# EAGLE design telemetria (EAGLE 9.7.0)

## Sheet 1 of 2
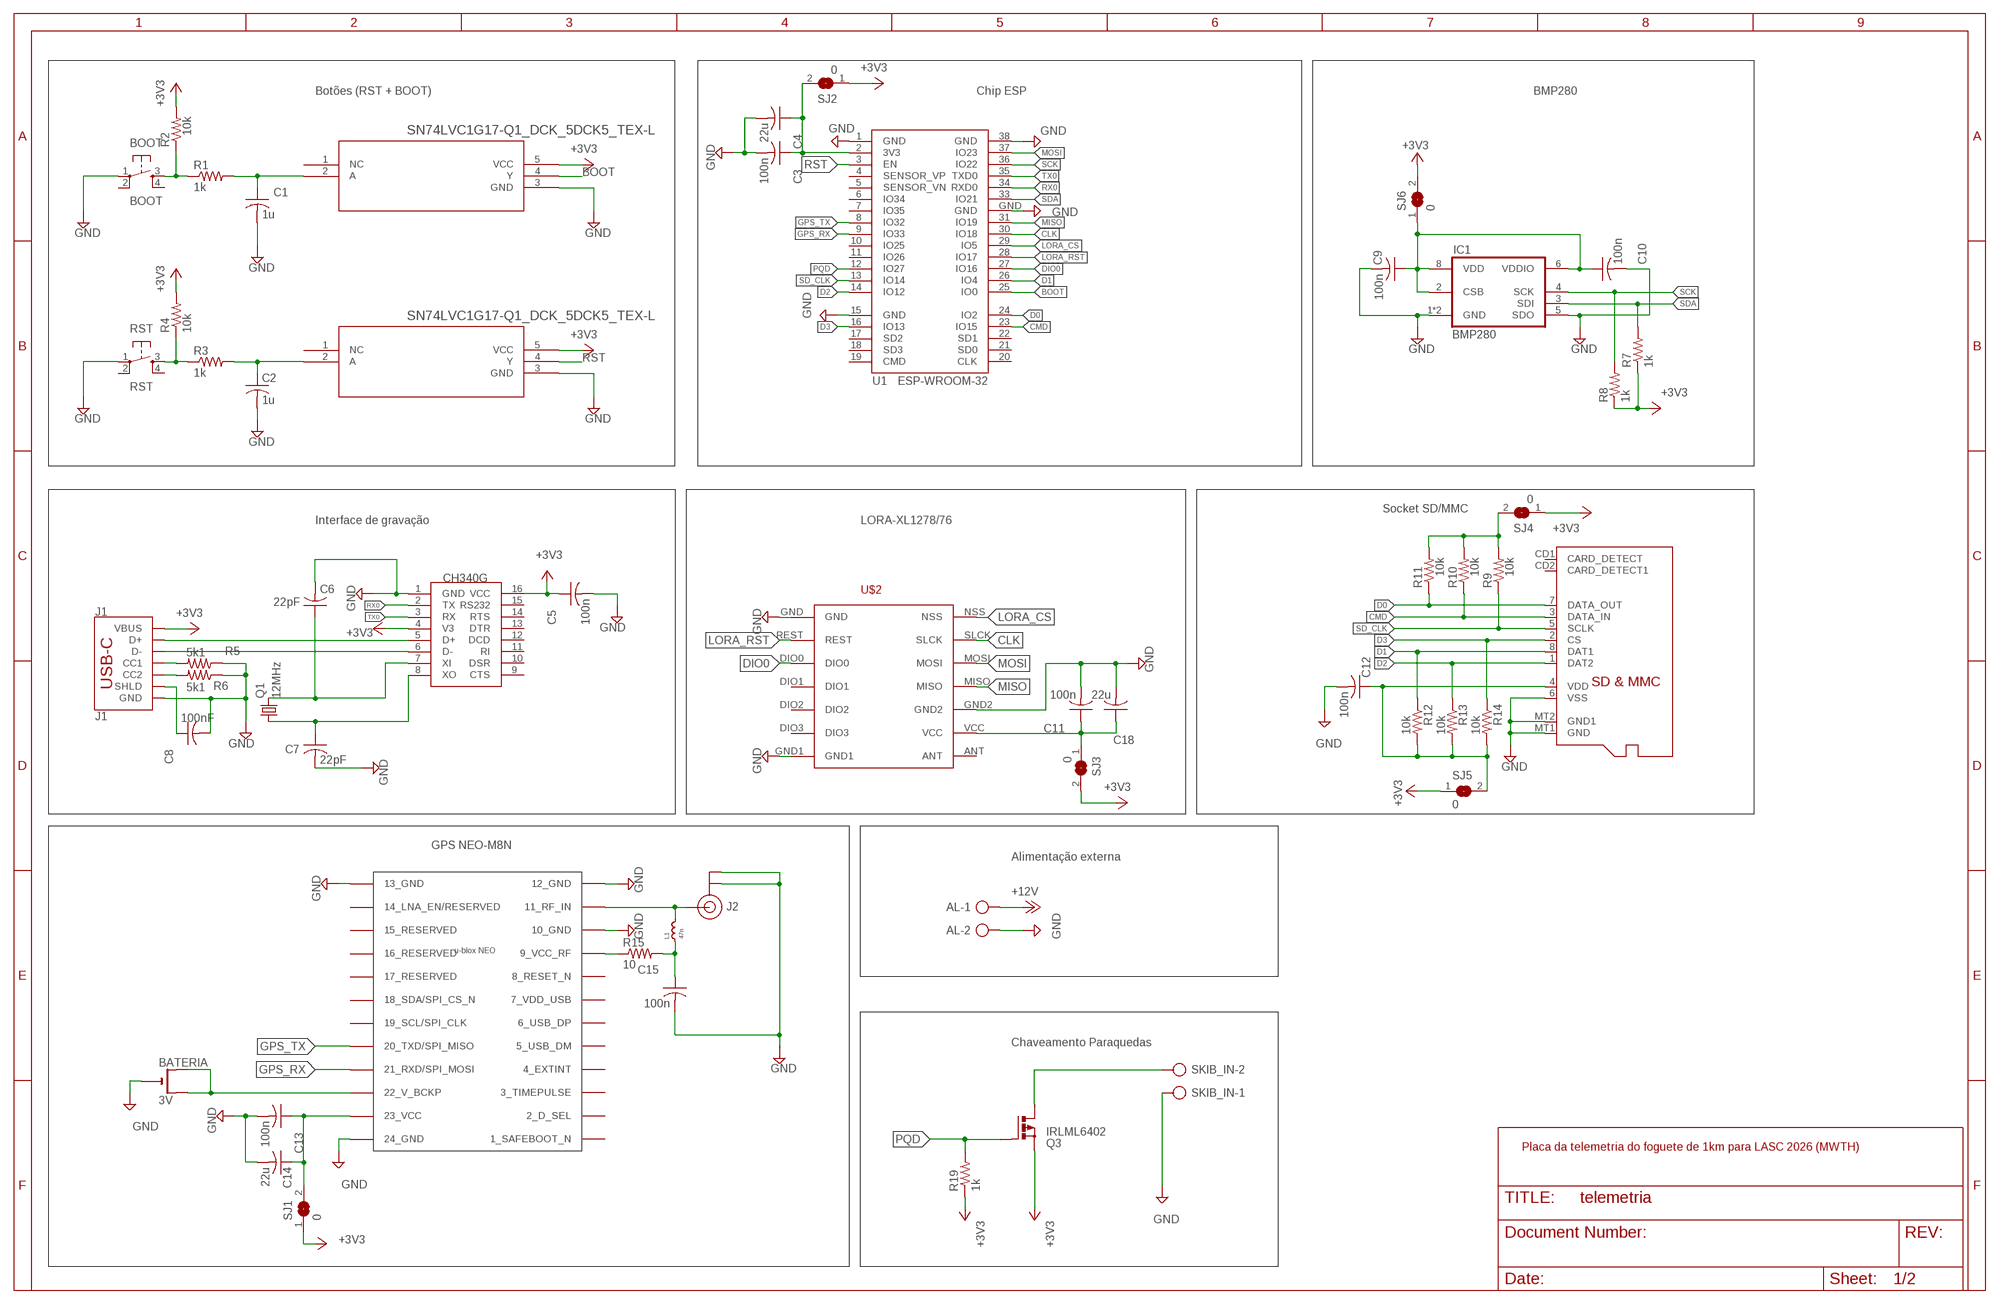
[diagram p0: schematic, sheet 1]

### Parts
AL  AL  AK500/2-H  [AK500/2-H]
BATERIA  3V  CR2032THM  [CR2032-THRU]
BOOT  BOOT  TAC_SWITCHPTH  [TACTILE-PTH]
C1  1u  C-USC3216  [C3216]
C2  1u  C-USC3216  [C3216]
C3  100n  C-USC3216  [C3216]
C4  22u  C-USC3216  [C3216]
C5  100n  C-USC3216  [C3216]
C6  22pF  C-USC3216  [C3216]
C7  22pF  C-USC3216  [C3216]
C8  100nF  C-USC3216  [C3216]
C9  100n  C-USC3216  [C3216]
C10  100n  C-USC3216  [C3216]
C11  100n  C-USC3216  [C3216]
C12  100n  C-USC3216  [C3216]
C13  100n  C-USC3216  [C3216]
C14  22u  C-USC3216  [C3216]
C15  100n  C-USC3216  [C3216]
C18  22u  C-USC3216  [C3216]
IC1  BMP280  [BMP280]
J1  J1  USB_C_2-LAYER_PADS  [USB-C-16P-2LAYER-PADS]
J2  U.FL  [U.FL]
L1  47n  RF-INDUCTOR.0402  [0402]
Q1  12MHz  CRYSTALHC49S  [HC49/S]
Q3  IRLML6402  [SOT-23]
R1  1k  R-US_R1206  [R1206]
R2  10k  R-US_R1206  [R1206]
R3  1k  R-US_R1206  [R1206]
R4  10k  R-US_R1206  [R1206]
R5  5k1  R-US_R1206  [R1206]
R6  5k1  R-US_R1206  [R1206]
R7  1k  R-US_R1206  [R1206]
R8  1k  R-US_R1206  [R1206]
R9  10k  R-US_R1206  [R1206]
R10  10k  R-US_R1206  [R1206]
R11  10k  R-US_R1206  [R1206]
R12  10k  R-US_R1206  [R1206]
R13  10k  R-US_R1206  [R1206]
R14  10k  R-US_R1206  [R1206]
R15  10  R-US_R1206  [R1206]
R19  1k  R-US_R1206  [R1206]
RST  RST  TAC_SWITCHPTH  [TACTILE-PTH]
SCHMITT-1  SN74LVC1G17-Q1_DCK_5DCK5_TEX-L  [DCK5_TEX-L]
SCHMITT-2  SN74LVC1G17-Q1_DCK_5DCK5_TEX-L  [DCK5_TEX-L]
SJ1  0  SJ  [SJ]
SJ2  0  SJ  [SJ]
SJ3  0  SJ  [SJ]
SJ4  0  SJ  [SJ]
SJ5  0  SJ  [SJ]
SJ6  0  SJ  [SJ]
SKIB_IN  SKIB  AK500/2-H  [AK500/2-H]
U1  ESP-WROOM-32  [ESP-WROOM-32]
U$1  CH340G  [SOIC16]
U$2  LORA  [LORAXL1276/78]
U$3  MICROSD  [MICROSD]
U$4  NEO-M8  [NEO-M8]

### Nets
3V3: R9.2 R10.2 R11.2 SJ4.2
3V3_GPS: C13.1 C14.1 SJ1.2 U$4.23(23_VCC)
+3V3: C5.1 J1.VBUS1(VBUS) J1.VBUS2(VBUS) Q3.P2(S) R2.2 R4.2 R7.1 R8.1 R19.1 SCHMITT-1.5(VCC) SCHMITT-2.5(VCC) SJ1.1 SJ2.1 SJ3.2 SJ4.1 SJ5.1 SJ6.2 U$1.4(V3) U$1.16(VCC) ; also sheet 2
+12V: AL.1 ; also sheet 2
BOOT: SCHMITT-1.4(Y) U1.25(IO0)
CLK: U1.30(IO18) U$2.SLCK
CMD: R10.1 U1.23(IO15) U$3.3(DATA_IN)
D0: R11.1 U1.24(IO2) U$3.7(DATA_OUT)
D1: R12.1 U1.26(IO4) U$3.8(DAT1)
D2: R13.1 U1.14(IO12) U$3.1(DAT2)
D3: R14.1 U1.16(IO13) U$3.2(CS)
DIO0: U1.27(IO16) U$2.DIO0
ESP_VCC: C3.1 C4.1 SJ2.2 U1.2(3V3)
GND: AL.2 BOOT.1 C1.2 C2.2 C3.2 C4.2 C5.2 C6.2 C7.2 C8.2 C9.2 C10.2 C11.2 C12.2 C13.2 C14.2 C15.2 C18.2 IC1.1(GND) IC1.5(SDO) IC1.7(GND) J1.GND J1.GND2(GND) J2.1(GND) J2.2(GND) R5.1 R6.1 RST.1 SCHMITT-1.3(GND) SCHMITT-2.3(GND) SKIB_IN.1 U1.1(GND) U1.15(GND) U1.38(GND) U1.GND U$1.1(GND) U$2.GND U$2.GND1 U$2.GND2 U$3.6(VSS) U$3.MT1(GND) U$3.MT2(GND1) U$4.10(10_GND) U$4.12(12_GND) U$4.13(13_GND) ; also sheet 2
GPS_RX: U1.9(IO33) U$4.21(21_RXD/SPI_MOSI)
GPS_TX: U1.8(IO32) U$4.20(20_TXD/SPI_MISO)
LORA_CS: U1.29(IO5) U$2.NSS
LORA_RST: U1.28(IO17) U$2.REST
MISO: U1.31(IO19) U$2.MISO
MOSI: U1.37(IO23) U$2.MOSI
N$1: BOOT.3 R1.1 R2.1
N$2: C1.1 R1.2 SCHMITT-1.2(A)
N$3: R3.1 R4.1 RST.3
N$4: C2.1 R3.2 SCHMITT-2.2(A)
N$5: C7.1 Q1.1 U$1.8(XO)
N$6: C6.1 Q1.2 U$1.7(XI)
N$9: C8.1 J1.SHLD1(SHLD) J1.SHLD2(SHLD) J1.SHLD3(SHLD) J1.SHLD4(SHLD)
N$10: J1.A5(CC1) R5.2
N$11: J1.B5(CC2) R6.2
N$12: BATERIA.- U$4.24(24_GND) ; supply symbol labelled GND
N$13: J2.FEED(SIGNAL) L1.2 U$4.11(11_RF_IN)
N$14: C15.1 L1.1 R15.2
N$15: R15.1 U$4.9(9_VCC_RF)
N$16: BATERIA.+1(+) BATERIA.+2(+1) U$4.22(22_V_BCKP)
N$18: C11.1 C18.1 SJ3.1 U$2.VCC
N$20: Q3.P3(D) SKIB_IN.2
PQD: Q3.P1(G) R19.2 U1.12(IO27)
RST: SCHMITT-2.4(Y) U1.3(EN)
RX0: U1.34(RXD0) U$1.2(TX)
SCK: IC1.4(SCK) R8.2 U1.36(IO22)
SD_CLK: R9.1 U1.13(IO14) U$3.5(SCLK)
SDA: IC1.3(SDI) R7.2 U1.33(IO21)
SJ_3V3: C9.1 C10.1 IC1.2(CSB) IC1.6(VDDIO) IC1.8(VDD) SJ6.1
TX0: U1.35(TXD0) U$1.3(RX)
USBD_N: J1.A7(D-) J1.B7(D-) U$1.6(D-)
USBD_P: J1.A6(D+) J1.B6(D+) U$1.5(D+)
VDD: C12.1 R12.2 R13.2 R14.2 SJ5.2 U$3.4(VDD)
Unconnected: BOOT.2 BOOT.4 RST.2 RST.4 SCHMITT-1.1(NC) SCHMITT-2.1(NC) U1.4(SENSOR_VP) U1.5(SENSOR_VN) U1.6(IO34) U1.7(IO35) U1.10(IO25) U1.11(IO26) U1.17(SD2) U1.18(SD3) U1.19(CMD) U1.20(CLK) U1.21(SD0) U1.22(SD1) U$1.9(CTS) U$1.10(DSR) U$1.11(RI) U$1.12(DCD) U$1.13(DTR) U$1.14(RTS) U$1.15(RS232) U$2.ANT U$2.DIO1 U$2.DIO2 U$2.DIO3 U$3.CD1(CARD_DETECT) U$3.CD2(CARD_DETECT1) U$4.1(1_SAFEBOOT_N) U$4.2(2_D_SEL) U$4.3(3_TIMEPULSE) U$4.4(4_EXTINT) U$4.5(5_USB_DM) U$4.6(6_USB_DP) U$4.7(7_VDD_USB) U$4.8(8_RESET_N) U$4.14(14_LNA_EN/RESERVED) U$4.15(15_RESERVED) U$4.16(16_RESERVED) U$4.17(17_RESERVED) U$4.18(18_SDA/SPI_CS_N) U$4.19(19_SCL/SPI_CLK)

### Notes on the sheet
- Botões (RST + BOOT) | Chip ESP | BMP280
- Socket SD/MMC
- Interface de gravação | LORA-XL1278/76
- GPS NEO-M8N
- Alimentação externa
- Chaveamento Paraquedas
- Placa da telemetria do foguete de 1km para LASC 2026 (MWTH)

## Sheet 2 of 2
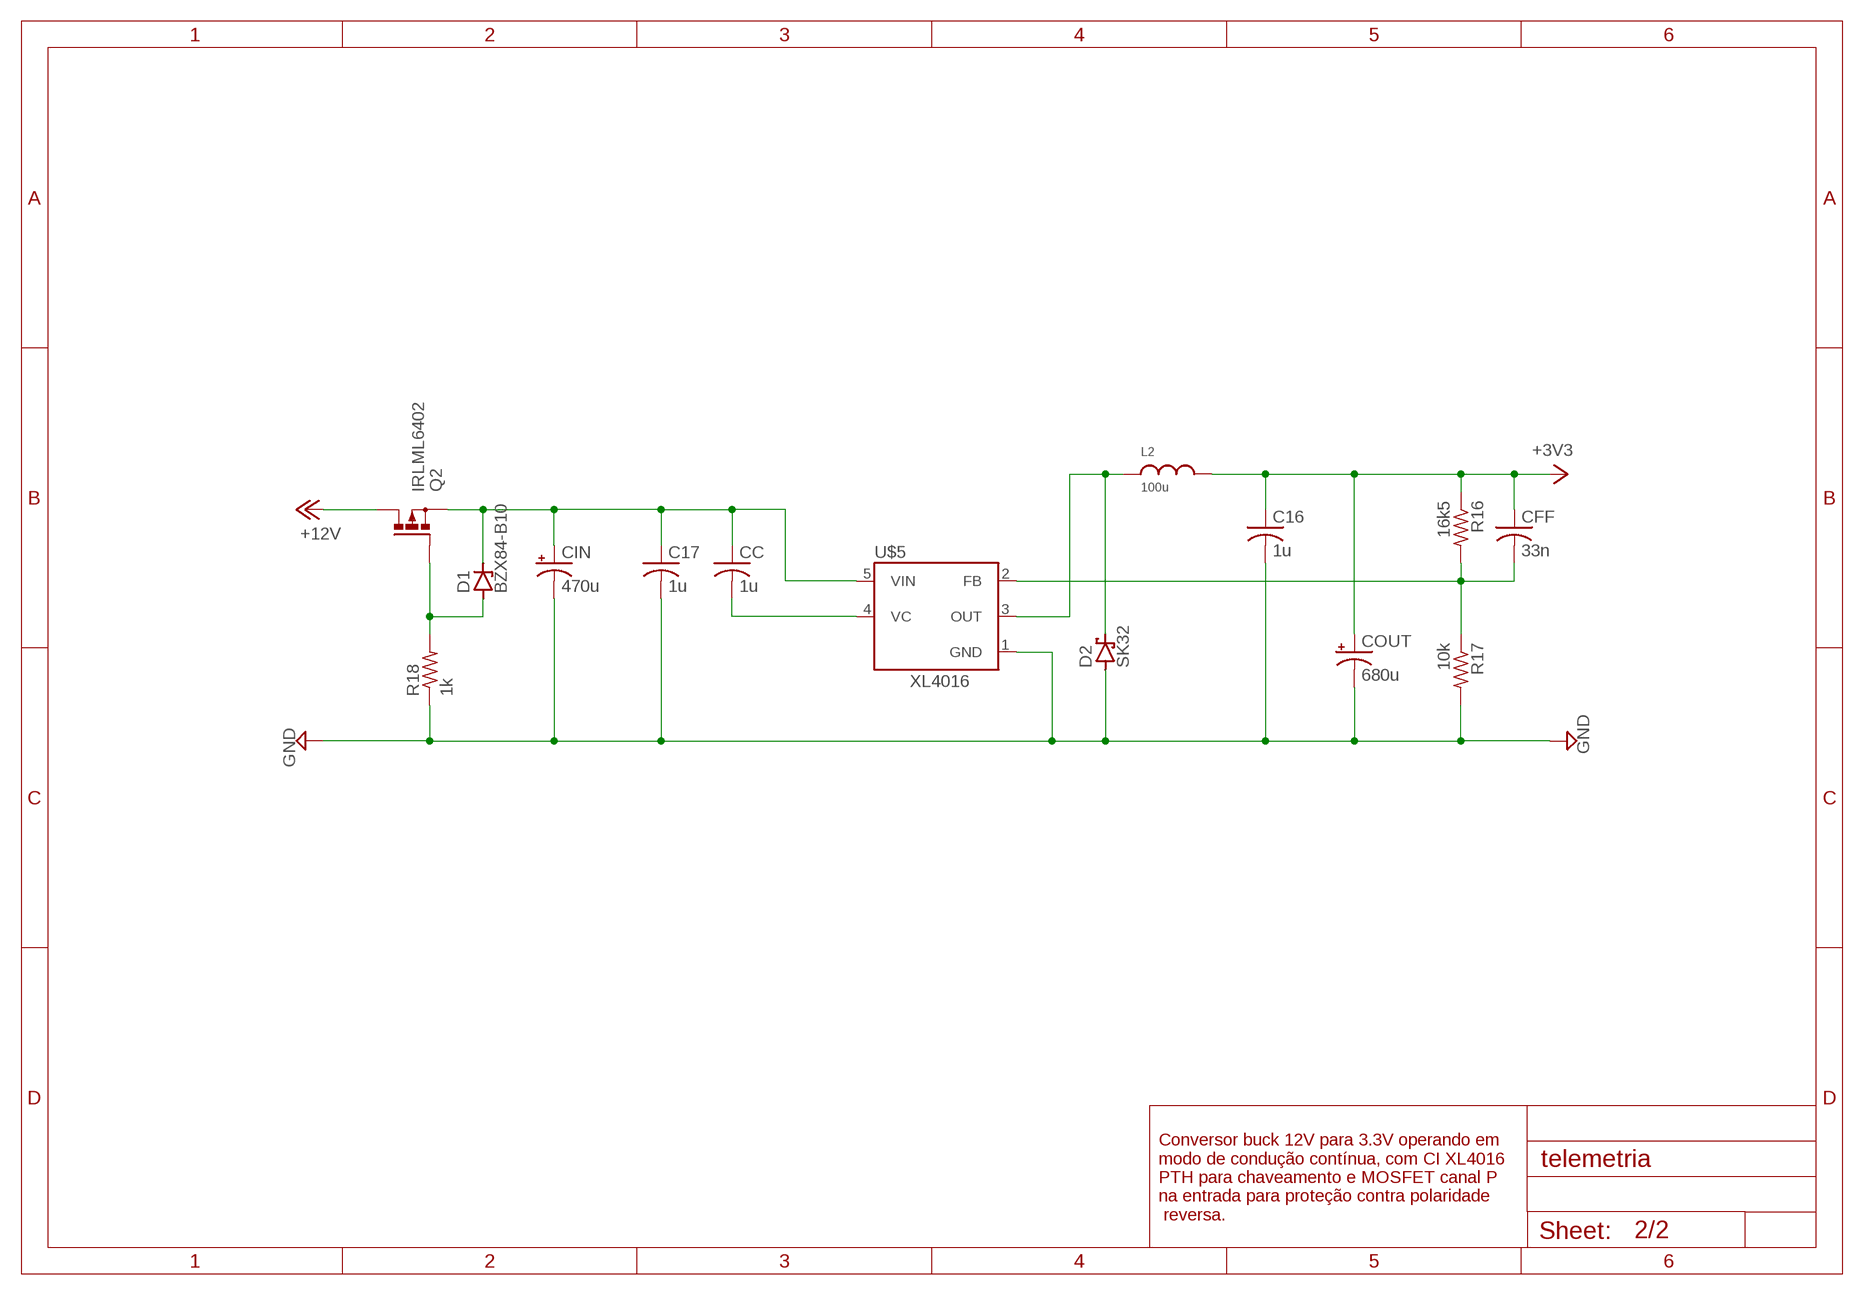
[diagram p1: schematic, sheet 2]

### Parts
C16  1u  C-USC1206  [C1206]
C17  1u  C-USC1206  [C1206]
CC  1u  C-USC1206  [C1206]
CFF  33n  C-USC1206  [C1206]
CIN  470u  CPOL-USE3.5-8  [E3,5-8]
COUT  680u  CPOL-USE3.5-8  [E3,5-8]
D1  BZX84-B10  ZENER-DIODESOT23  [SOT23]
D2  SK32  SCHOTTKY-DIODESMC  [SMC]
L2  100u  INDUCTOR_125125  [INDUTOR_125125]
Q2  IRLML6402  [SOT-23]
R16  16k5  R-US_R1206  [R1206]
R17  10k  R-US_R1206  [R1206]
R18  1k  R-US_M1206  [M1206]
U$5  XL4016  [LM2576T2]

### Nets
+3V2: C17.1 CC.1 CIN.+ D1.3(C) Q2.P2(S) U$5.5(VIN)
+3V3: C16.1 CFF.1 COUT.+ L2.P$2 R16.1 ; also sheet 1
+12V: Q2.P3(D) ; also sheet 1
BYPASS: CC.2 U$5.4(VC)
FB: CFF.2 R16.2 R17.1 U$5.2(FB)
GND: C16.2 C17.2 CIN.- COUT.- D2.A R17.2 R18.1 U$5.1(GND) ; also sheet 1
N$19: D1.1(A) Q2.P1(G) R18.2
SWOUT: D2.C L2.P$1 U$5.3(OUT)

### Notes on the sheet
- Conversor buck 12V para 3.3V operando em
  modo de condução contínua, com CI XL4016
  PTH para chaveamento e MOSFET canal P
  na entrada para proteção contra polaridade
   reversa.

## Library data of the parts
AL SKIB_IN = con-ptr500:AK500/2-H: CONNECTOR Aug. 2004 / PTR Meßtechnik: Die Bezeichnung der Serie AK505 wurde geändert. Es handelt sich hierbei um AK500 in horizontaler Ausführung.
BATERIA = adafruit:CR2032
BOOT RST = SparkFun-Retired:TAC_SWITCH: Momentary Switch Button commonly used for reset or general input. Spark Fun Electronics SKU : COM-00097 SMT- SWCH-08247
C1-C18 CC CFF = adafruit:C-US: CAPACITOR, American symbol
CIN COUT = adafruit:CPOL-US: POLARIZED CAPACITOR, American symbol
D1 = diode:ZENER-DIODE: Z-Diode
D2 = diode:SCHOTTKY-DIODE: Schottky Diode
IC1 = bosch-bmp280:BMP280: The BMP280 is an absolute barometric pressure sensor especially designed for mobile applications. The sensor module is housed in an extremely compact 8-pin metal-lid LGA package with a footprint of only 2.0 × 2.5 mm2 and 0.95 mm package height. Its small dimensions and its low power consumption of 2.7 μA @1Hz allow the implementation in battery driven devices such as mobile phones, GPS modules or watches. The library has been designed by Richard Magdycz <https://www.facebook.com/groups/eaglecadsoftUK>
J1 = SparkFun-Connectors:USB_C: USB Type C 16Pin Connector Super Speed pins not available on the 16-pin purely SMD connector so this part is best for USB 2.0 implementations. D1 and D2 are tied together enabling D+/- no matter which way the cable is plugged into the connector. The two channel configuration pins (CC1/2) are exposed. These are normally connected to ground via 5.1k resistors but can be reconfigured for high current/high power applications. **4-LAYER BOARD WARNING!!** If designing 4-layer board, make sure to select the variant _4-LAYER-ISOLATED. The linked footprint (USB-C-16-4LAYER-ISOLATED) includes some very necessary cutout polygons in the inner layers (2 and 15). This prevents the PTH mounting shield legs on the USB connector from electrically connecting any other polygons on the inner layers (usually VCC and GND).
J2 = SparkFun-Connectors:U.FL: SMD Antenna Connector - U.FL 2mm height, 3.0mm x 3.0mm receptacle size. SparkFun Products: SparkFun WiFi Shield - ESP8266 <https://www.sparkfun.com/products/13287> SparkFun ESP8266 Thing <https://www.sparkfun.com/products/13231> SparkFun MiniGen - Pro Mini Signal Generator Shield <https://www.sparkfun.com/products/11420>
L1 = standardparts:RF-INDUCTOR
L2 = inductor:INDUCTOR_125125
Q1 = adafruit:CRYSTAL: CRYSTAL
Q2 Q3 = mosfet:IRLML6402: Pch MOSFET IRLML6402 20V 3.7A http://akizukidenshi.com/catalog/g/gI-02553/ I-02553
R1-R19 = adafruit:R-US_: RESISTOR, American symbol
SCHMITT-1 SCHMITT-2 = SN74LVC1G17:SN74LVC1G17-Q1_DCK_5
SJ1-SJ6 = jumper:SJ: SMD solder JUMPER
U1 = esp32:ESP-WROOM-32: Espressif Systems ESP-WROOM-32
U$1 = ch340g:CH340G
U$2 = lora-xl1276-8:LORA
U$3 = adafruit:MICROSD: Micro-SD / Transflash card holder with SPI pinout For the 3M # 2908-05WB-MG and/or 4UCON #19656 push-push type
U$4 = ubloxLib:NEO-M8: u-blox NEO GNSS module
U$5 = XL4016:XL4016: Check availability <https://pricing.snapeda.com/parts/XL4016/XLSEMI/view-part?ref=eda>

## Board
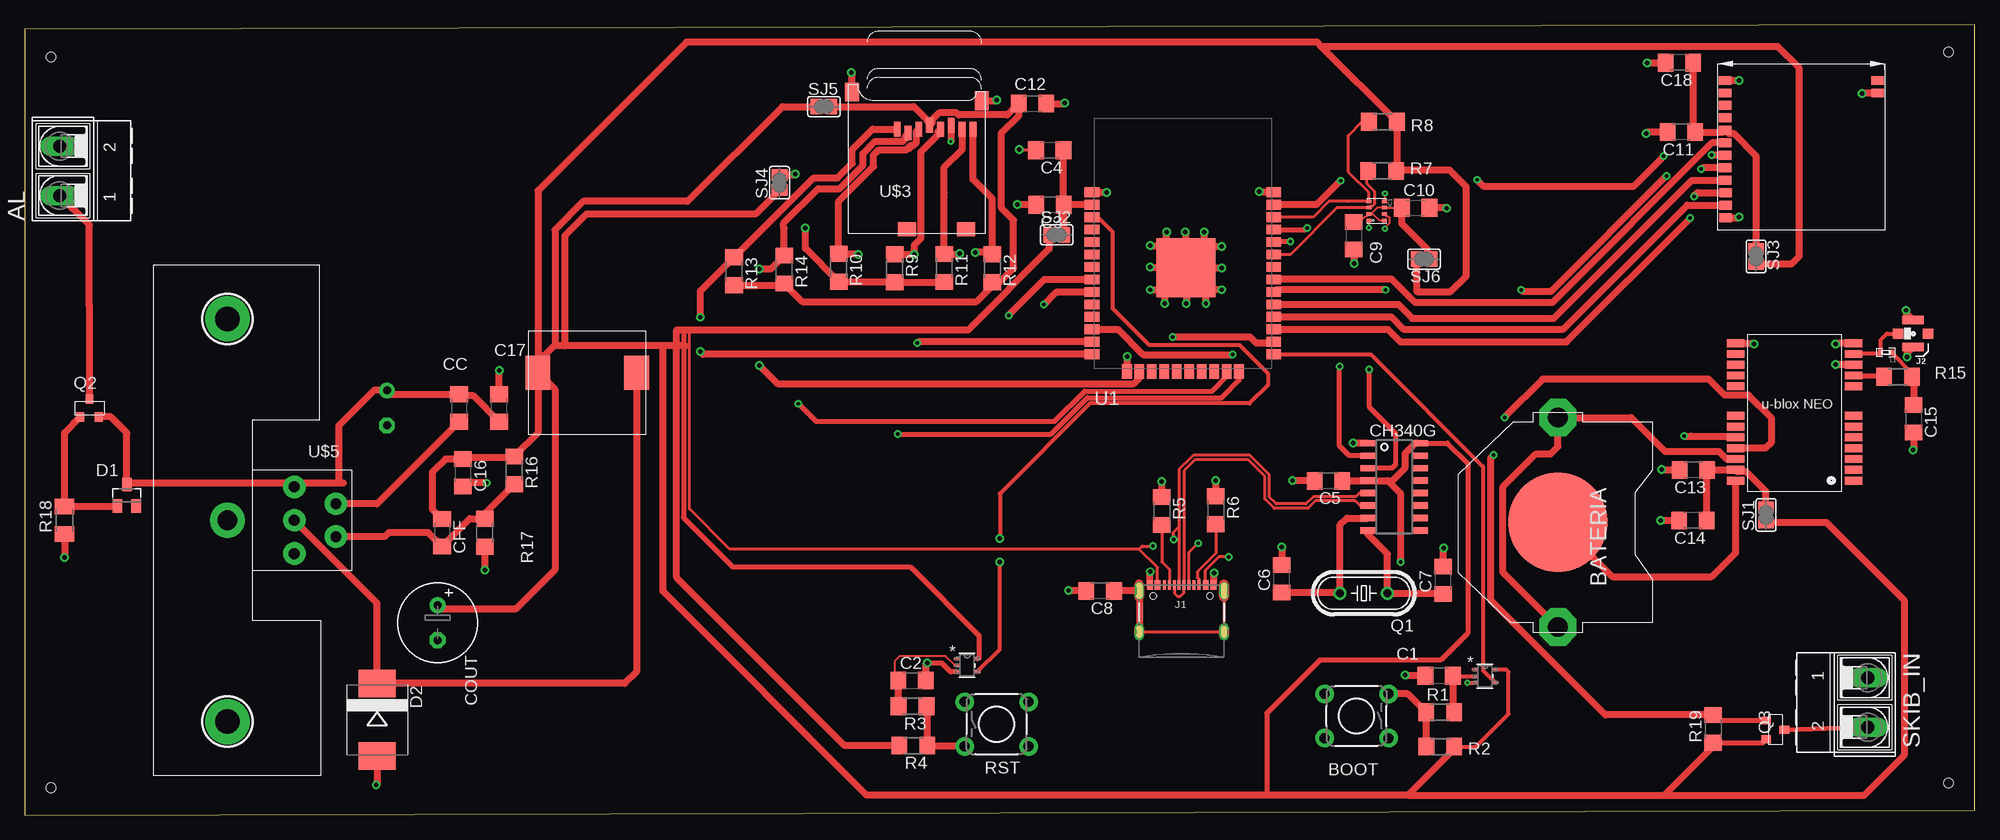
[diagram p2: board, top side]
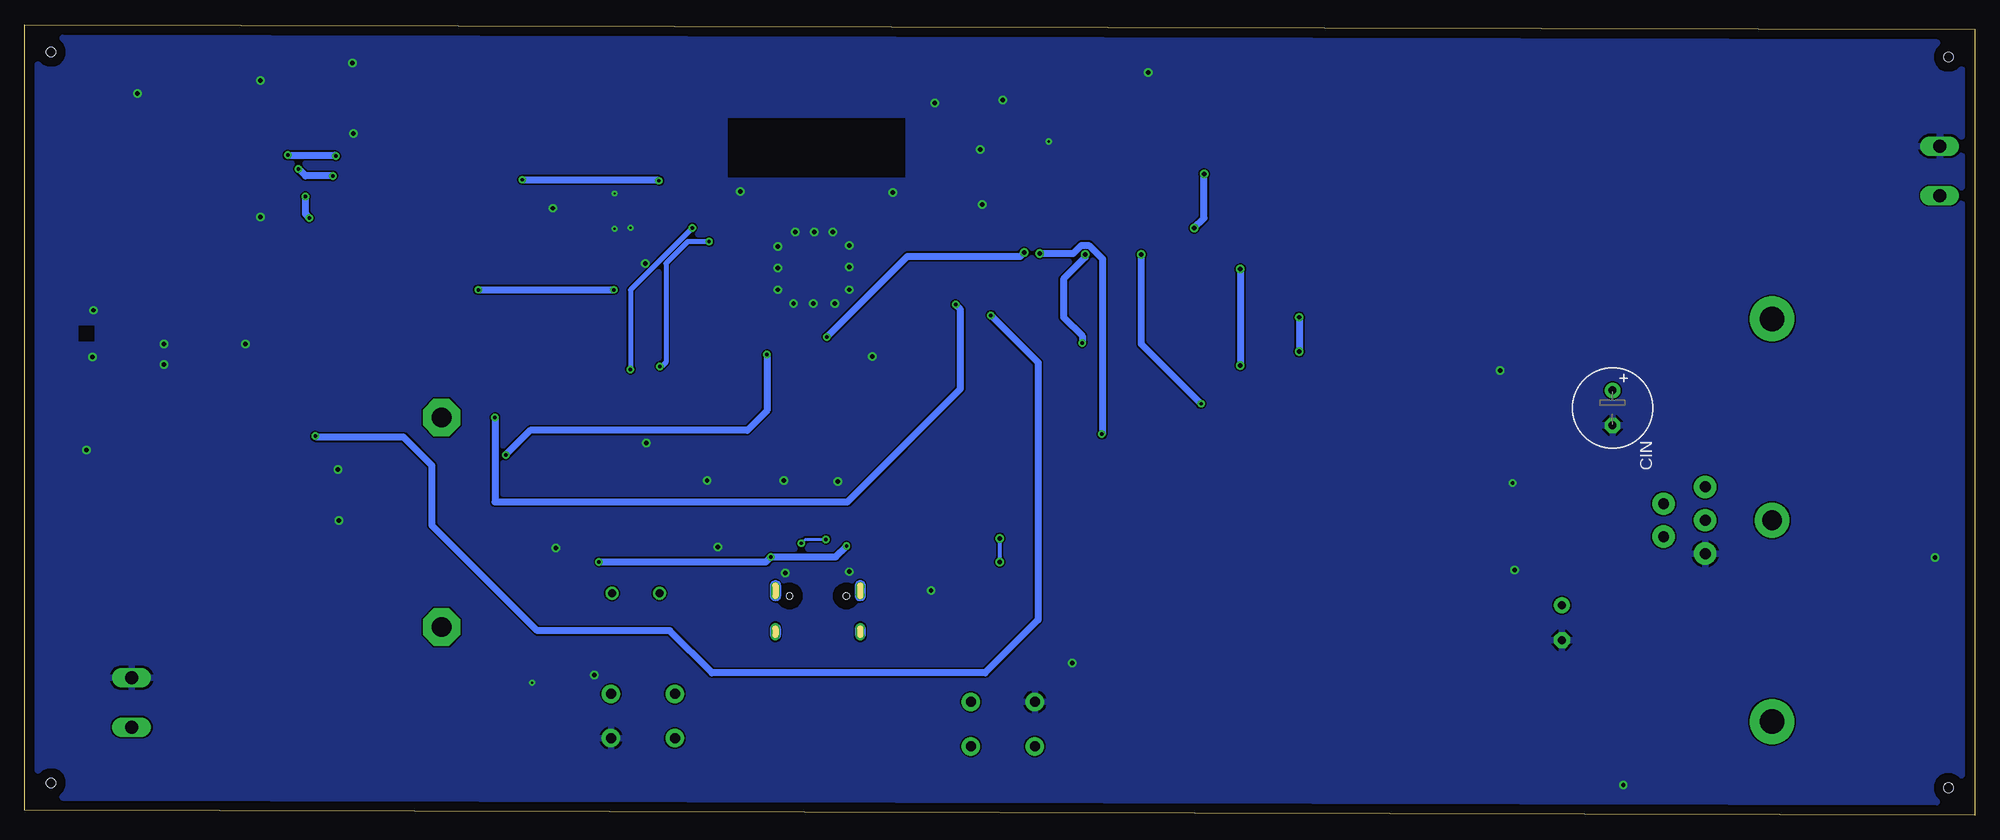
[diagram p3: board, bottom side, seen from below]

Size 198.6 x 80.5 mm. Coordinates in mm from the lower left corner, seen from the top.
Outline: 0,0 198.6,0.5 198.6,80.5 0,80 0,0
Copper layers (1*16): Top / Bottom
Stack-up Default Layer Stack: Top User Defined 0.035mm / Dielectric-1 User Defined 1.5mm / Bottom User Defined 0.035mm
Design rules: minimum copper width 6mil, minimum drill size 0.35mm, copper clearance wire_polygon to wire_polygon 6mil, copper clearance wire_polygon to pad_smd 6mil, copper clearance wire_polygon to via 6mil, copper clearance pad_smd to pad_smd 6mil, copper clearance pad_smd to via 6mil, copper clearance via to via 6mil, copper clearance smd to pad (same net) 6mil, copper clearance smd to via (same net) 6mil, copper clearance smd to smd (same net) 6mil, dimension clearance 40mil, via restrict clearance 0mil, restrict clearance 0mil, drill distance 6mil, keepout clearance 0mil
Holes 1 mm at 195.9,77.7 195.9,3.3 2.7,2.8 2.7,77.2

### Footprints (pad centres in the part's own frame; a part is rotated, then mirrored left to right if it is on the bottom)
AK500/2-H = drill 1.321 long: 1 -2.515,0; 2 2.515,0
CR2032-THRU = drill 2 pad 3.81 octagon: +1 -10.668,0; +2 10.668,0 | smd 10.16 x 10.16: - 0,0
TACTILE-PTH = drill 1.016 pad 1.88: 1 -3.251,2.261; 2 3.251,2.261; 3 -3.251,-2.261; 4 3.251,-2.261
C3216 = smd 1.6 x 1.8: 1 -1.4,0; 2 1.4,0
C1206 = smd 1.6 x 1.8: 1 -1.4,0; 2 1.4,0
E3,5-8 = drill 0.813 pad 1.6: + -1.778,0 | drill 0.813 pad 1.6 octagon: - 1.778,0
SOT23 = smd 1 x 1.4: 1 -0.95,-1.1; 2 0.95,-1.1; 3 0,1.1
SMC = smd 2.8 x 3.8: A 3.7,0; C -3.7,0
BMP280 = smd 0.35 x 0.5: 1 0.975,-0.8; 2 0.325,-0.8; 3 -0.325,-0.8; 4 -0.975,-0.8; 5 -0.975,0.8; 6 -0.325,0.8; 7 0.325,0.8; 8 0.975,0.8
USB-C-16P-2LAYER-PADS = smd 0.3 x 1: A5 -1.25,-0.34; A6 -0.25,-0.34; A7 0.25,-0.34; A8 1.25,-0.34; B5 1.75,-0.34; B6 0.75,-0.34; B7 -0.75,-0.34; B8 -1.75,-0.34 | smd 0.6 x 1: GND -3.225,-0.34; GND2 3.225,-0.34; VBUS1 -2.45,-0.34; VBUS2 2.45,-0.34 | drill 0.4 pad 0.6 long: SHLD1 -4.318,-0.915; SHLD2 4.318,-0.915; SHLD3 -4.318,-5.095; SHLD4 4.318,-5.095 | hole 0.65: -2.89,-1.445; 2.89,-1.445
U.FL = smd 2.2 x 0.85: 1 0,1.375; 2 0,-1.375 | smd 1.05 x 1: FEED 1.525,0; NC -1.525,0
0402 = smd 0.5 x 0.6: 1 -0.55,0; 2 0.55,0
INDUTOR_125125 = smd 2.5 x 3.5: P$1 4.831,0.045; P$2 -5.2,0.05
HC49/S = drill 0.813: 1 -2.413,0; 2 2.413,0
SOT-23 = smd 0.802 x 0.972: P1 -0.95,-0.917; P2 0.95,-0.917; P3 0,0.917
R1206 = smd 1.6 x 1.803: 1 -1.422,0; 2 1.422,0
M1206 = smd 1.6 x 2: 1 -1.4,0; 2 1.4,0
DCK5_TEX-L = smd 0.648 x 0.254: 1 -1.022,0.65; 2 -1.022,0; 3 -1.022,-0.65; 4 1.022,-0.65; 5 1.022,0.65
SJ = smd 1.168 x 1.6: 1 -0.762,0; 2 0.762,0
ESP-WROOM-32 = smd 1.5 x 1: 1 -9.25,7; 2 -9.25,5.73; 3 -9.25,4.46; 4 -9.25,3.19; 5 -9.25,1.92; 6 -9.25,0.65; 7 -9.25,-0.62; 8 -9.25,-1.89; 9 -9.25,-3.16; 10 -9.25,-4.43; 11 -9.25,-5.7; 12 -9.25,-6.97; 13 -9.25,-8.24; 14 -9.25,-9.51; 25 9.25,-9.51; 26 9.25,-8.24; 27 9.25,-6.97; 28 9.25,-5.7; 29 9.25,-4.43; 30 9.25,-3.16; 31 9.25,-1.89; 32 9.25,-0.62; 33 9.25,0.65; 34 9.25,1.92; 35 9.25,3.19; 36 9.25,4.46; 37 9.25,5.73; 38 9.25,7 | smd 1 x 1.5: 15 -5.7,-11.25; 16 -4.43,-11.25; 17 -3.16,-11.25; 18 -1.89,-11.25; 19 -0.62,-11.25; 20 0.65,-11.25; 21 1.92,-11.25; 22 3.19,-11.25; 23 4.46,-11.25; 24 5.73,-11.25 | smd 6 x 6: GND 0.3,-0.7
SOIC16 = smd 0.635 x 1.524: 1 -4.445,-2.695; 2 -3.175,-2.695; 3 -1.905,-2.695; 4 -0.635,-2.695; 5 0.635,-2.695; 6 1.905,-2.695; 7 3.175,-2.695; 8 4.445,-2.695; 9 4.445,2.695; 10 3.175,2.695; 11 1.905,2.695; 12 0.635,2.695; 13 -0.635,2.695; 14 -1.905,2.695; 15 -3.175,2.695; 16 -4.445,2.695
LORAXL1276/78 = smd 1.27 x 0.9: ANT 7.09,7.51; DIO0 -8.42,-3.92; DIO1 -8.43,6.24; DIO2 -8.43,4.97; DIO3 -8.43,3.7; GND -8.41,-6.46; GND1 -8.43,7.51; GND2 7.09,6.24; MISO -8.43,1.16; MOSI -8.43,-0.11; NSS -8.43,-2.65; REST -8.42,-5.19; SLCK -8.43,-1.38; VCC -8.43,2.43
MICROSD = smd 0.7 x 1.5: 1 9,-10.64; 2 7.9,-10.24; 3 6.8,-10.64; 4 5.7,-11.04; 5 4.6,-10.64; 6 3.5,-11.04; 7 2.4,-10.64; 8 1.3,-10.64 | smd 1.8 x 1.4: CD1 2,-0.44; CD2 8,-0.44 | smd 1.4 x 1.9: MT1 0.4,-13.54; MT2 13.6,-14.44
NEO-M8 = smd 1.8 x 0.8: 1 6.4,-7.4; 2 6.4,-6.3; 3 6.4,-5.2; 4 6.4,-4.1; 5 6.4,-3; 6 6.4,-1.9; 7 6.4,-0.8; 8 6.4,2.2; 9 6.4,3.3; 10 6.4,4.4; 11 6.4,5.5; 12 6.4,6.6; 13 -5.6,6.6; 14 -5.6,5.5; 15 -5.6,4.4; 16 -5.6,3.3; 17 -5.6,2.2; 18 -5.6,-0.8; 19 -5.6,-1.9; 20 -5.6,-3; 21 -5.6,-4.1; 22 -5.6,-5.2; 23 -5.6,-6.3; 24 -5.6,-7.4
LM2576T2 = drill 1.1 pad 2.286: 1 -3.404,-6.807; 2 -1.676,-11.049; 3 0,-6.807; 4 1.676,-11.049; 5 3.404,-6.807 | drill 2.032 pad 3.556: 6 0,0 | drill 2.489 pad 4.572: 7 20.498,0; 8 -20.498,0

### Placement (x,y rotation side)
AL  3.59,65.61 90 top
BATERIA  156.13,29.83 270 top
BOOT  135.63,10.11 180 top
C1  144.04,14.2 180 top
C2  90.38,13.72 0 top
C3  104.41,62.15 180 top
C4  104.4,67.7 180 top
C5  132.76,34.05 180 top
C6  128.02,24.09 90 top
C7  144.45,23.94 90 top
C8  109.52,22.84 180 top
C9  135.35,59.01 270 top
C10  141.64,61.85 0 top
C11  168.71,69.55 180 top
C12  102.64,72.45 0 top
C13  169.91,35.15 180 top
C14  169.88,30 180 top
C15  192.35,40.36 270 top
C16  44.65,34.87 270 top
C17  48.33,41.47 90 top
C18  168.5,76.62 180 top
CC  44.25,41.47 270 top
CFF  42.52,28.77 270 top
CIN  36.9,41.47 270 bottom
COUT  42.06,19.61 270 top
D1  10.42,32.58 0 top
D2  35.9,9.72 270 top
IC1  137.68,61.53 270 top
J1  117.82,23.78 0 top
J2  192.3,49.04 180 top
L1  189.54,47.12 180 top
L2  57.49,45.01 0 top
Q1  136.37,22.61 180 top
Q2  6.61,41.47 0 top
Q3  178.27,8.7 270 top
R1  144.14,10.5 0 top
R2  144.16,7 0 top
R3  90.42,11.1 180 top
R4  90.5,7.1 180 top
R5  115.8,30.98 270 top
R6  121.3,31.06 270 top
R7  138.24,65.6 180 top
R8  138.32,70.6 180 top
R9  88.6,55.7 270 top
R10  82.91,55.74 270 top
R11  93.65,55.72 270 top
R12  98.55,55.7 270 top
R13  72.25,55.38 270 top
R14  77.35,55.56 270 top
R15  190.76,44.65 0 top
R16  49.87,35.12 270 top
R17  46.87,28.77 270 top
R18  4.07,30.04 90 top
R19  171.94,8.8 90 top
RST  98.98,9.29 0 top
SCHMITT-1  148.72,14.17 0 top
SCHMITT-2  95.98,15.26 0 top
SJ1  177.32,30.58 90 top
SJ2  105.1,59.09 0 top
SJ3  176.31,56.9 270 top
SJ4  76.87,64.4 90 top
SJ5  81.4,72.15 0 top
SJ6  142.5,56.63 180 top
SKIB_IN  187.7,11.49 270 top
U1  117.94,56.44 0 top
U$1  139.46,33.44 270 top
U$2  181.61,67.3 0 top
U$3  97.86,59.21 180 top
U$4  179.83,41.47 0 top
U$5  20.66,30.04 90 top

### Tracks (layer width: path | path; a pad name or v marks a point on that pad's centre or on a via)
3V3  (via drill 0.45)
  Top 0.7: R11.2 94.2,54.3 94.18,54.28 R9.2 88.56,54.32 R10.2 79.5,57.72 v79.5,59.8 | v78.5,65.3 78.36,65.16 SJ4.2
  Bottom 0.7: v79.5,59.8 78.5,60.8 v78.5,65.3
3V3_GPS
  Top 0.7: C14.1 171.31,30.03 C13.1 171.33,35.17 U$4.23 174.43,34.97 175.34,34.97 177.32,32.99 SJ1.2
+3V2
  Top 0.152: 43.87,43.25 CC.1 | 32.3,33.68 32.47,33.85
  Top 0.2: 32.3,33.68 27.7,33.68 U$5.5 | D1.3 10.59,33.85 | CC.1 44.38,42.74
  Top 0.7: 10.59,33.85 32.01,33.85 | 32.01,33.85 32.47,33.85 | D1.3 10.42,38.93 8.8,40.55 Q2.P2 | CC.1 37.28,42.87 CIN.+ 35.6,43.25 32.01,39.66 32.01,33.85 | 44.38,42.74 45.66,42.74 C17.1
+3V3  (via drill 0.35)
  Top 0.152: 49.79,36.47 R16.1 | 44.52,36.39 C16.1 | 42.06,20.88 42.06,21 COUT.+
  Top 0.2: C16.1 44.85,36.47
  Top 0.3: J1.VBUS1 115.37,25.23 113.5,27.1 | 113.5,27.1 71.8,27.1 67.7,31.2 67.7,49.4 | v122.6,26.3 121.6,26.3 120.27,24.97 J1.VBUS2 | 113.5,27.1 113.8,27.4 v114.9,27.4
  Top 0.4: R2.2 145.8,7 147.8,7 151.1,10.3 151.1,14.6 150.88,14.82 SCHMITT-1.5
  Top 0.5: 141.78,37.88 U$1.16 144.88,37.88 144.9,37.9 146.95,35.85 146.95,18.55 144.2,15.8 131.9,15.8 126.5,10.4 126.5,2.07 | Q3.P2 176.98,7.38 172.3,7.38 R19.1 171.94,7.14 | 67.1,49.4 67.1,30.3 72.1,25.3 90.2,25.3 97.2,18.3 97.2,16.11 SCHMITT-2.5
  Top 0.7: C16.1 42.86,36.27 41.52,34.93 41.52,31.17 CFF.1 | 44.85,36.47 49.79,36.47 | L2.P$2 52.29,38.96 R16.1 | L2.P$2 54,43.35 54,25 50,21 42.06,21 | 67.3,47.8 65,47.8 | 65,47.8 55,47.8 | 55,47.8 53.9,47.8 | 53.9,47.8 52.1,46 52.75,45.35 | R4.2 83.5,7.1 66.4,24.2 66.4,49.4 67.1,49.4 67.7,49.4 96.08,49.4 104.34,57.65 SJ2.1 | 140.87,2.07 126.5,2.07 85.73,2.07 65,22.8 65,47.8 | 139.74,65.68 R7.1 | 139.74,65.68 R8.1 132.08,78.27 | SJ6.2 141.74,53.36 141.8,53.3 145.2,53.3 146.8,54.9 146.8,64 145.12,65.68 139.74,65.68 | L2.P$2 52.29,63.59 67.4,78.7 131.64,78.7 132.08,78.27 | 53.9,47.8 54,47.9 54,59.6 56.9,62.5 67.51,62.5 77.16,72.15 SJ5.1 | SJ4.1 74.43,61.2 57.2,61.2 55,59 55,47.8 | SJ3.2 179.94,56.14 180.7,56.9 180.7,76.1 178.53,78.27 132.08,78.27 | 141.78,37.88 141.63,37.88 140.6,36.85 140.6,35.4 139.28,34.08 138.8,34.08 | 145.8,7 140.87,2.07 | 140.87,2.07 166.99,2.07 | 166.99,2.07 172.3,7.38 | 166.99,2.07 167.05,2 187.3,2 191.4,6.1 191.4,21.9 183.48,29.82 SJ1.1 | C5.1 136.74,34.05 U$1.4 138.8,34.08 | 138.8,34.08 140.1,32.77 v140.1,25.8
  Bottom 0.7: v140.1,25.8 123.1,25.8 v122.6,26.3 116,26.3 v114.9,27.4
+12V
  Top 0.7: AL.1 6.59,60.09 6.59,51.98 6.61,51.81 Q2.P3
BOOT
  Top 0.4: U1.25 137.07,46.93 148.5,35.5 148.5,14.76 SCHMITT-1.4
BYPASS
  Top 0.7: CC.2 35.9,31.72 U$5.4
CLK  (via drill 0.35)
  Top 0.7: U$2.SLCK 170.82,65.92 v170.7,65.8 | v167.2,65.1 155.4,53.3 152.6,53.3 v152.4,53.5 | v138.6,53.5 127.41,53.5 U1.30
  Bottom 0.7: v170.7,65.8 170,65.1 v167.2,65.1 | v152.4,53.5 v138.6,53.5
CMD  (via drill 0.35, 0.45)
  Top 0.5: v78.8,41.9 80.6,40.1 104.88,40.1 107.96,43.19 120.94,43.19 122.4,44.64 U1.23
  Top 0.7: v84.9,57.1 84.84,57.16 R10.1 82.91,62.49 82.9,62.5 86.46,66.06 86.46,67.25 86.71,67.5 86.96,67.75 89.77,67.75 89.93,67.9 | 89.93,67.9 90.22,68.2 90.52,68.2 90.81,68.49 90.81,69.6 U$3.3 | 90.3,68.1 90.11,67.9 89.93,67.9
  Bottom 0.7: v84.9,57.1 84.9,48 v78.8,41.9
D0  (via drill 0.35, 0.45)
  Top 0.5: v88.9,38.8 104.5,38.8 108.23,42.53 121.93,42.53 123.67,44.27 U1.24
  Top 0.7: v95.23,57.2 95.17,57.14 R11.1 93.65,62.9 93.65,63.35 93.65,65.95 95.5,67.8 95.5,69.81 U$3.7
  Bottom 0.7: v88.9,38.8 88.83,38.87 88.83,56.65 90.22,58.03 90.98,58.03 91.82,57.2 v95.23,57.2
D1  (via drill 0.35, 0.45)
  Top 0.7: v96.8,57.3 98.37,57.3 R12.1 98.55,62.75 96.56,64.74 U$3.8 | v116.9,48.7 124.8,48.7 125.4,48.1 127.09,48.1 U1.26
  Bottom 0.7: v96.8,57.3 97.2,56.9 108.7,56.9 v116.9,48.7
D2  (via drill 0.45)
  Top 0.7: v68.8,50.7 68.8,53.35 R13.1 80.35,64.9 82.8,64.9 84.26,66.36 84.26,67.75 86.36,69.85 U$3.1 | U1.14 69.07,46.93 v68.8,47.2
  Bottom 0.7: v68.8,50.7 v68.8,47.2
D3  (via drill 0.45)
  Top 0.7: v74.8,55.6 75.97,55.6 R14.1 77.35,59.75 77.3,59.8 77.3,60.3 80.8,63.8 83,63.8 85.36,66.17 85.36,67.35 86.61,68.6 89.42,68.6 89.71,68.89 89.71,69.2 U$3.2 | v74.8,45.8 76.66,43.94 112.95,43.94 113.51,44.5 U1.16
  Bottom 0.7: v74.8,55.6 v74.8,45.8
DIO0  (via drill 0.35)
  Top 0.7: U1.27 138.83,49.47 140.1,48.2 157,48.2 v169.6,60.8 | v170,63 170.38,63.38 U$2.DIO0
  Bottom 0.7: v169.6,60.8 170,61.2 v170,63
ESP_VCC
  Top 0.7: U1.2 105.83,62.17 | 105.83,62.17 C3.1 C4.1 | SJ2.2 105.86,62.14 105.83,62.17
FB
  Top 0.7: R16.2 46.87,30.7 R17.1 45.34,30.19 CFF.2 41.12,28.77 37.09,28.77 36.68,28.36 U$5.2
GND  (via drill 0.2, 0.25, 0.35, 0.45)
  Top 0.2: 45.03,33.85 C16.2 | IC1.1 136.88,59.82 v136.9,59.8 | v138.5,59.7 138.5,59.79 138.98,60.27 138.98,60.84 138.84,60.98 138.7,60.98 IC1.7 | IC1.5 138.48,63.28 v138.5,63.3
  Top 0.3: C4.2 101.38,67.7 v101.28,67.8
  Top 0.4: SCHMITT-1.3 147.68,13.5 v146.92,13.5
  Top 0.5: SCHMITT-2.3 94.29,14.61 93.4,15.5 v91.9,15.5
  Top 0.7: R17.2 v46.87,24.96 | C17.2 v48.33,45.28 | v47.06,33.85 45.03,33.85 | R18.1 v4.07,26.23 | D2.A 35.9,3.17 v35.8,3.07 | C3.2 101.15,62.15 v101.1,62.2 | v116.1,52.1 116.1,53.6 | 116.1,53.6 117.5,55 118.3,54.2 v118.3,52.1 | v120.3,52.1 120.3,53.7 119.8,54.2 | v121.9,53.5 119.8,53.5 | v121.9,55.7 120.5,55.7 | v121.9,57.9 120.7,57.9 120.6,58 120.6,58.1 | v120.1,59.4 120.1,58.3 119.9,58.1 | v118.2,59.4 118.2,58.2 118.1,58.1 | v116.3,59.4 116.3,57.9 116.2,57.8 116,58 v114.6,58 | v114.6,55.8 116.2,55.8 | v114.6,53.5 116,53.5 116.1,53.6 | U1.1 110.16,63.44 v110.2,63.4 | U1.15 112.24,46.64 v112.3,46.7 | U1.38 125.76,63.44 v125.7,63.5 | C8.2 106.36,22.84 v106.3,22.9 | J1.GND v114.59,24.8 v114.6,24.8 | J1.GND2 121.05,24.64 121.08,24.68 v121.12,24.68 | R5.1 v115.8,34 | R6.1 v121.3,34.1 | U$1.1 135.31,37.88 v135.3,37.9 | C11.2 165.25,69.55 v165.1,69.4 | U$2.GND2 188.66,73.5 v187.1,73.5 | U$2.GND1 v174.59,74.81 v174.6,74.8 | U$2.GND 174.54,60.84 v174.6,60.9 | C18.2 165.22,76.62 v165.2,76.6 | C13.2 166.75,35.15 v166.7,35.2 | C14.2 v166.6,30 | U$4.13 176.03,48.07 v176.1,48 | U$4.12 184.47,48.07 v184.4,48 | U$4.10 184.43,45.87 v184.4,45.9 | C15.2 192.35,37.25 v192.3,37.2 | J2.1 191.7,47.06 v191.7,46.66 | J2.2 191.6,51.12 v191.6,51.42 | 84.26,73.75 U$3.MT2 84.26,75.52 v84.18,75.6 | C10.2 144.75,61.85 v144.8,61.8 | C2.2 91.78,15.38 v91.9,15.5 | C1.2 140.7,14.2 v140.6,14.3 | C6.2 128.02,27.28 v128,27.3 | C7.2 144.45,27.15 v144.5,27.2 | C5.2 129.15,34.05 v129.1,34.1 | U$3.MT1 98.95,72.75 v99,72.8 | U$3.6 94.36,68.66 v94.3,68.6 | C9.2 135.39,57.57 v135.39,56.19 | C12.2 105.85,72.45 v105.9,72.5
  pour Bottom: 232.35,82.35 -2.35,82.35 -2.35,-2.35 232.35,-2.35
GPS_RX  (via drill 0.35)
  Top 0.7: U$4.21 174.26,37.4 177.3,37.4 177.9,38 177.9,40.4 175.53,42.77 173.12,42.77 171.49,44.4 154.6,44.4 v150.7,40.5 | v103.8,52 105.08,53.28 U1.9
  Bottom 0.7: v150.7,40.5 150.7,31.9 114.8,31.9 103.3,43.4 103.3,51.5 v103.8,52
GPS_TX  (via drill 0.35)
  Top 0.7: U1.8 103.85,54.55 v100.2,50.9 | v169,38.6 169.7,38.6 169.73,38.57 174.13,38.57 U$4.20
  Bottom 0.7: v100.2,50.9 95.4,46.1 95.4,19.9 100.8,14.5 128.6,14.5 132.9,18.8 146.4,18.8 157.1,29.5 157.1,35.6 160,38.5 168.9,38.5 v169,38.6
LORA_CS
  Top 0.7: U1.29 139.89,52.01 141.3,50.6 155.7,50.6 169.75,64.65 U$2.NSS
LORA_RST
  Top 0.7: U1.28 139.16,50.74 140.4,49.5 156.7,49.5 169.31,62.11 U$2.REST
MISO
  Top 0.7: U1.31 139.25,54.55 141.6,52.2 155.56,52.2 171.81,68.46 U$2.MISO
MOSI  (via drill 0.35)
  Top 0.7: U$2.MOSI v171.81,67.19 v171.8,67.2 | v166.9,67.1 163.8,64 148.6,64 v147.9,64.7 | v134,64.6 131.57,62.17 U1.37
  Bottom 0.7: v171.8,67.2 167,67.2 v166.9,67.1 | v147.9,64.7 134.1,64.7 v134,64.6
N$1
  Top 0.7: R2.1 142.72,7.02 R1.1 140.85,12.37 BOOT.3
N$2
  Top 0.4: SCHMITT-1.2 145.47,14.17 C1.1
  Top 0.7: R1.2 145.44,10.62 C1.1
N$3
  Top 0.7: RST.3 95.66,7.1 R4.1 91.92,11.02 R3.1
N$4
  Top 0.2: SCHMITT-2.2 94.74,15.26 93.8,16.2 89.1,16.2 88.6,15.7 88.6,14.1 C2.1
  Top 0.7: R3.2 88.98,11.12 C2.1
N$5
  Top 0.7: C7.1 138.85,22.54 Q1.1 138.78,26.62 136.76,28.64 U$1.8
N$6
  Top 0.7: C6.1 133.88,22.69 Q1.2 133.96,29.56 134.66,30.27 U$1.7
N$9
  Top 0.3: J1.SHLD3 122.1,18.68 | 122.1,18.68 J1.SHLD4 | J1.SHLD2 122.14,18.72 122.1,18.68
  Top 0.7: C8.1 113.48,22.84 J1.SHLD1 J1.SHLD3
N$10
  Top 0.3: R5.2 115.8,25.8 116.57,25.03 J1.A5
N$11
  Top 0.3: J1.B5 119.57,24.07 119.42,24.22 119.42,24.5 119.42,24.78 121.3,26.66 R6.2
N$12
  Top 0.7: BATERIA.- 161.66,24.3 171.8,24.3 174.23,26.73 U$4.24
N$13
  Top 0.4: U$4.11 188.84,46.97 L1.2 188.99,48.39 189.64,49.04 J2.FEED
N$14
  Top 0.4: L1.1 192.18,45.03 R15.2
  Top 0.7: R15.2 192.35,44.48 C15.1
N$15
  Top 0.5: U$4.9 189.22,44.77 R15.1
N$16
  Top 0.7: U$4.22 173.32,36.27 172.54,37.05 167.05,37.05 163.6,40.5 BATERIA.+1 156.13,37.53 155.4,36.8 153.9,36.8 150.55,33.45 150.55,24.74 BATERIA.+2
N$18
  Top 0.7: C18.1 169.9,69.76 C11.1 173,69.55 U$2.VCC 173.5,69.41 174.02,69.41 176.31,67.13 SJ3.1
N$19
  Top 0.152: 4.39,31.76 R18.2
  Top 0.2: 9.43,31.44 D1.1
  Top 0.7: 9.43,31.44 R18.2 4.07,38.96 Q2.P1
N$20
  Top 0.5: Q3.P3 187.68,9 SKIB_IN.2
PQD  (via drill 0.35)
  Top 0.5: Q3.P1 172.51,9.65 R19.2
  Top 0.7: U1.12 111.33,49.47 113.9,46.9 v123,46.9 | v149.6,36.7 149.3,36.4 149.3,21.9 160.98,10.22 R19.2
  Bottom 0.7: v123,46.9 123,41.2 125,39.2 147.1,39.2 v149.6,36.7
RST  (via drill 0.45)
  Top 0.4: SCHMITT-2.4 99.3,16.91 v99.3,25.8 | U1.3 109.3,60.9 110.8,59.4 110.8,51.6 114.5,47.9 123.7,47.9 126.6,45 126.6,43.8 124.73,41.93 108.48,41.93 99.3,32.75 v99.3,28.2
  Bottom 0.4: v99.3,25.8 v99.3,28.2
RX0  (via drill 0.35)
  Top 0.5: U$1.2 134.88,36.62 133.9,37.6 v133.9,45.7 | v128.9,58.4 127.23,58.4 U1.34
  Bottom 0.5: v133.9,45.7 133.7,45.7 133.3,46.1 133.3,56.18 131.08,58.4 v128.9,58.4
SCK
  Top 0.3: R8.2 136.2,70.6 134.8,69.2 134.8,65.49 135.89,64.4 135.9,64.4 136.88,63.42 IC1.4 134.71,62.51 134.7,62.5 132.82,62.5 131.22,60.9 U1.36
SD_CLK  (via drill 0.35, 0.45)
  Top 0.7: R9.1 88.62,57.1 v90.6,57.1 90.6,58.08 91.26,58.74 91.26,67.54 93.01,69.29 93.01,69.6 U$3.5 | U1.13 91,48.2 v90.9,48.1
  Bottom 0.7: v90.6,57.1 90.6,56.8 92.8,54.6 92.8,50.7 90.9,48.8 v90.9,48.1
SDA
  Top 0.3: R7.2 136.7,65.48 136.7,64.3 137.5,63.5 137.5,62.27 137.25,62.03 137.05,62.03 IC1.3 133.66,61.85 128.89,57.09 U1.33
SJ_3V3
  Top 0.2: C10.1 IC1.6 137.75,61.85 137.1,61.2 | IC1.8 137.94,60.55 137.29,61.2 137.1,61.2 | 137.1,61.2 IC1.2 136.66,60.98 136.53,60.98 135.95,60.41 C9.1
  Top 0.7: SJ6.1 142.82,57.07 142.82,57.64 140.24,60.22 C10.1
SWOUT
  Top 0.152: 62.57,44.81 L2.P$1
  Top 0.7: L2.P$1 62.32,14.63 61.11,13.42 D2.C 35.9,21.61 U$5.3
TX0  (via drill 0.35)
  Top 0.5: U1.35 130.43,59.63 v130.6,59.8 | v136.9,45.4 136.9,41.6 139.6,38.9 139.6,35.7 139.25,35.34 U$1.3
  Bottom 0.5: v130.6,59.8 136.9,53.5 v136.9,45.4
USBD_N
  Top 0.3: 137.21,31.54 U$1.6 136.73,31.5 136,31.5 135.5,32 131.44,32 130.69,31.25 127.27,31.25 126.3,32.21 126.3,34.5 124.6,36.2 119.2,36.2 118.07,35.07 J1.A7 118.07,22.67 117.7,22.3 117.4,22.3 117.07,22.63 J1.B7
USBD_P  (via drill 0.35)
  Top 0.3: 117.57,29.4 117.57,35.21 118.88,36.52 | 117.57,29.4 J1.A6 | 118.88,36.52 | 118.88,36.52 119.01,36.65 124.79,36.65 124.92,36.52 | 124.92,36.52 | 124.92,36.52 126.75,34.69 126.75,32.4 127.45,31.7 130.5,31.7 131.25,32.45 135.55,32.45 135.91,32.8 U$1.5 | J1.B6 118.57,26.77 v119.5,27.7 | v117,28.1 117,28.63 117,28.83 117.57,29.4
  Bottom 0.3: v119.5,27.7 119.1,28.1 v117,28.1
VDD
  Top 0.7: 98.9,54.28 R12.2 | 98.9,54.28 99.28,54.28 100.7,55.7 100.7,60.6 99.5,61.8 99.5,69.5 101.24,71.24 C12.1 100.09,71.3 95.12,71.3 94.92,71.5 93.1,71.5 92.41,70.81 92.41,70.5 92.25,70.34 | R13.2 77.17,53.96 R14.2 79.19,52.3 96.92,52.3 98.9,54.28 | 92.25,70.34 U$3.4 | 92.25,70.34 91.91,70.69 91.91,70.81 90.57,72.15 SJ5.2